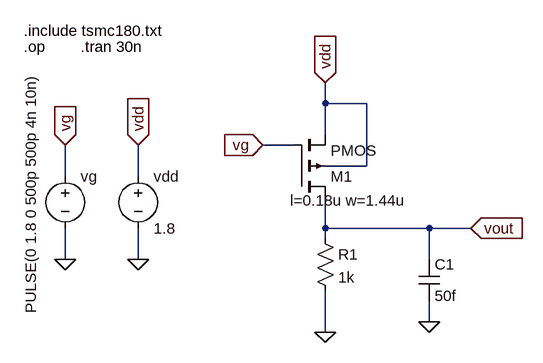
[diagram p0: schematic strong1weak0pmossetup.asc]
strong1weak0pmossetup.asc, the LTspice schematic file:
Version 4
SHEET 1 880 680
WIRE -272 112 -272 80
WIRE -208 112 -272 112
WIRE -272 160 -272 112
WIRE -320 176 -368 176
WIRE -208 208 -208 112
WIRE -208 208 -272 208
WIRE -672 224 -672 176
WIRE -560 224 -560 176
WIRE -272 304 -272 256
WIRE -112 304 -272 304
WIRE -48 304 -112 304
WIRE -272 320 -272 304
WIRE -672 352 -672 304
WIRE -560 352 -560 304
WIRE -112 352 -112 304
WIRE -112 448 -112 416
WIRE -272 464 -272 400
FLAG -672 352 0
FLAG -672 176 vg
IOPIN -672 176 In
FLAG -560 352 0
FLAG -560 176 vdd
IOPIN -560 176 In
FLAG -272 80 vdd
IOPIN -272 80 In
FLAG -368 176 vg
IOPIN -368 176 In
FLAG -272 464 0
FLAG -112 448 0
FLAG -48 304 vout
IOPIN -48 304 In
SYMBOL voltage -672 208 R0
WINDOW 123 0 0 Left 0
WINDOW 39 0 0 Left 0
WINDOW 3 -53 -144 VRight 2
SYMATTR InstName vg
SYMATTR Value PULSE(0 1.8 0 500p 500p 4n 10n)
SYMBOL voltage -560 208 R0
WINDOW 123 0 0 Left 0
WINDOW 39 0 0 Left 0
SYMATTR InstName vdd
SYMATTR Value 1.8
SYMBOL pmos4 -320 256 M180
WINDOW 123 -6 -5 Left 2
SYMATTR InstName M1
SYMATTR Value2 l=0.18u w=1.44u
SYMBOL res -288 304 R0
SYMATTR InstName R1
SYMATTR Value 1k
SYMBOL cap -128 352 R0
SYMATTR InstName C1
SYMATTR Value 50f
TEXT -736 24 Left 2 !.op
TEXT -736 0 Left 2 !.include tsmc180.txt
TEXT -648 24 Left 2 !.tran 30n

The netlist it stands for:
* strong1weak0pmossetup.asc
vg vg 0 PULSE(0 1.8 0 500p 500p 4n 10n)
vdd vdd 0 1.8
M1 vout vg vdd vdd PMOS l=0.18u w=1.44u
R1 vout 0 1k
C1 vout 0 50f
.model NMOS NMOS
.model PMOS PMOS
.lib standard.mos
.op
.include tsmc180.txt
.tran 30n
.backanno
.end